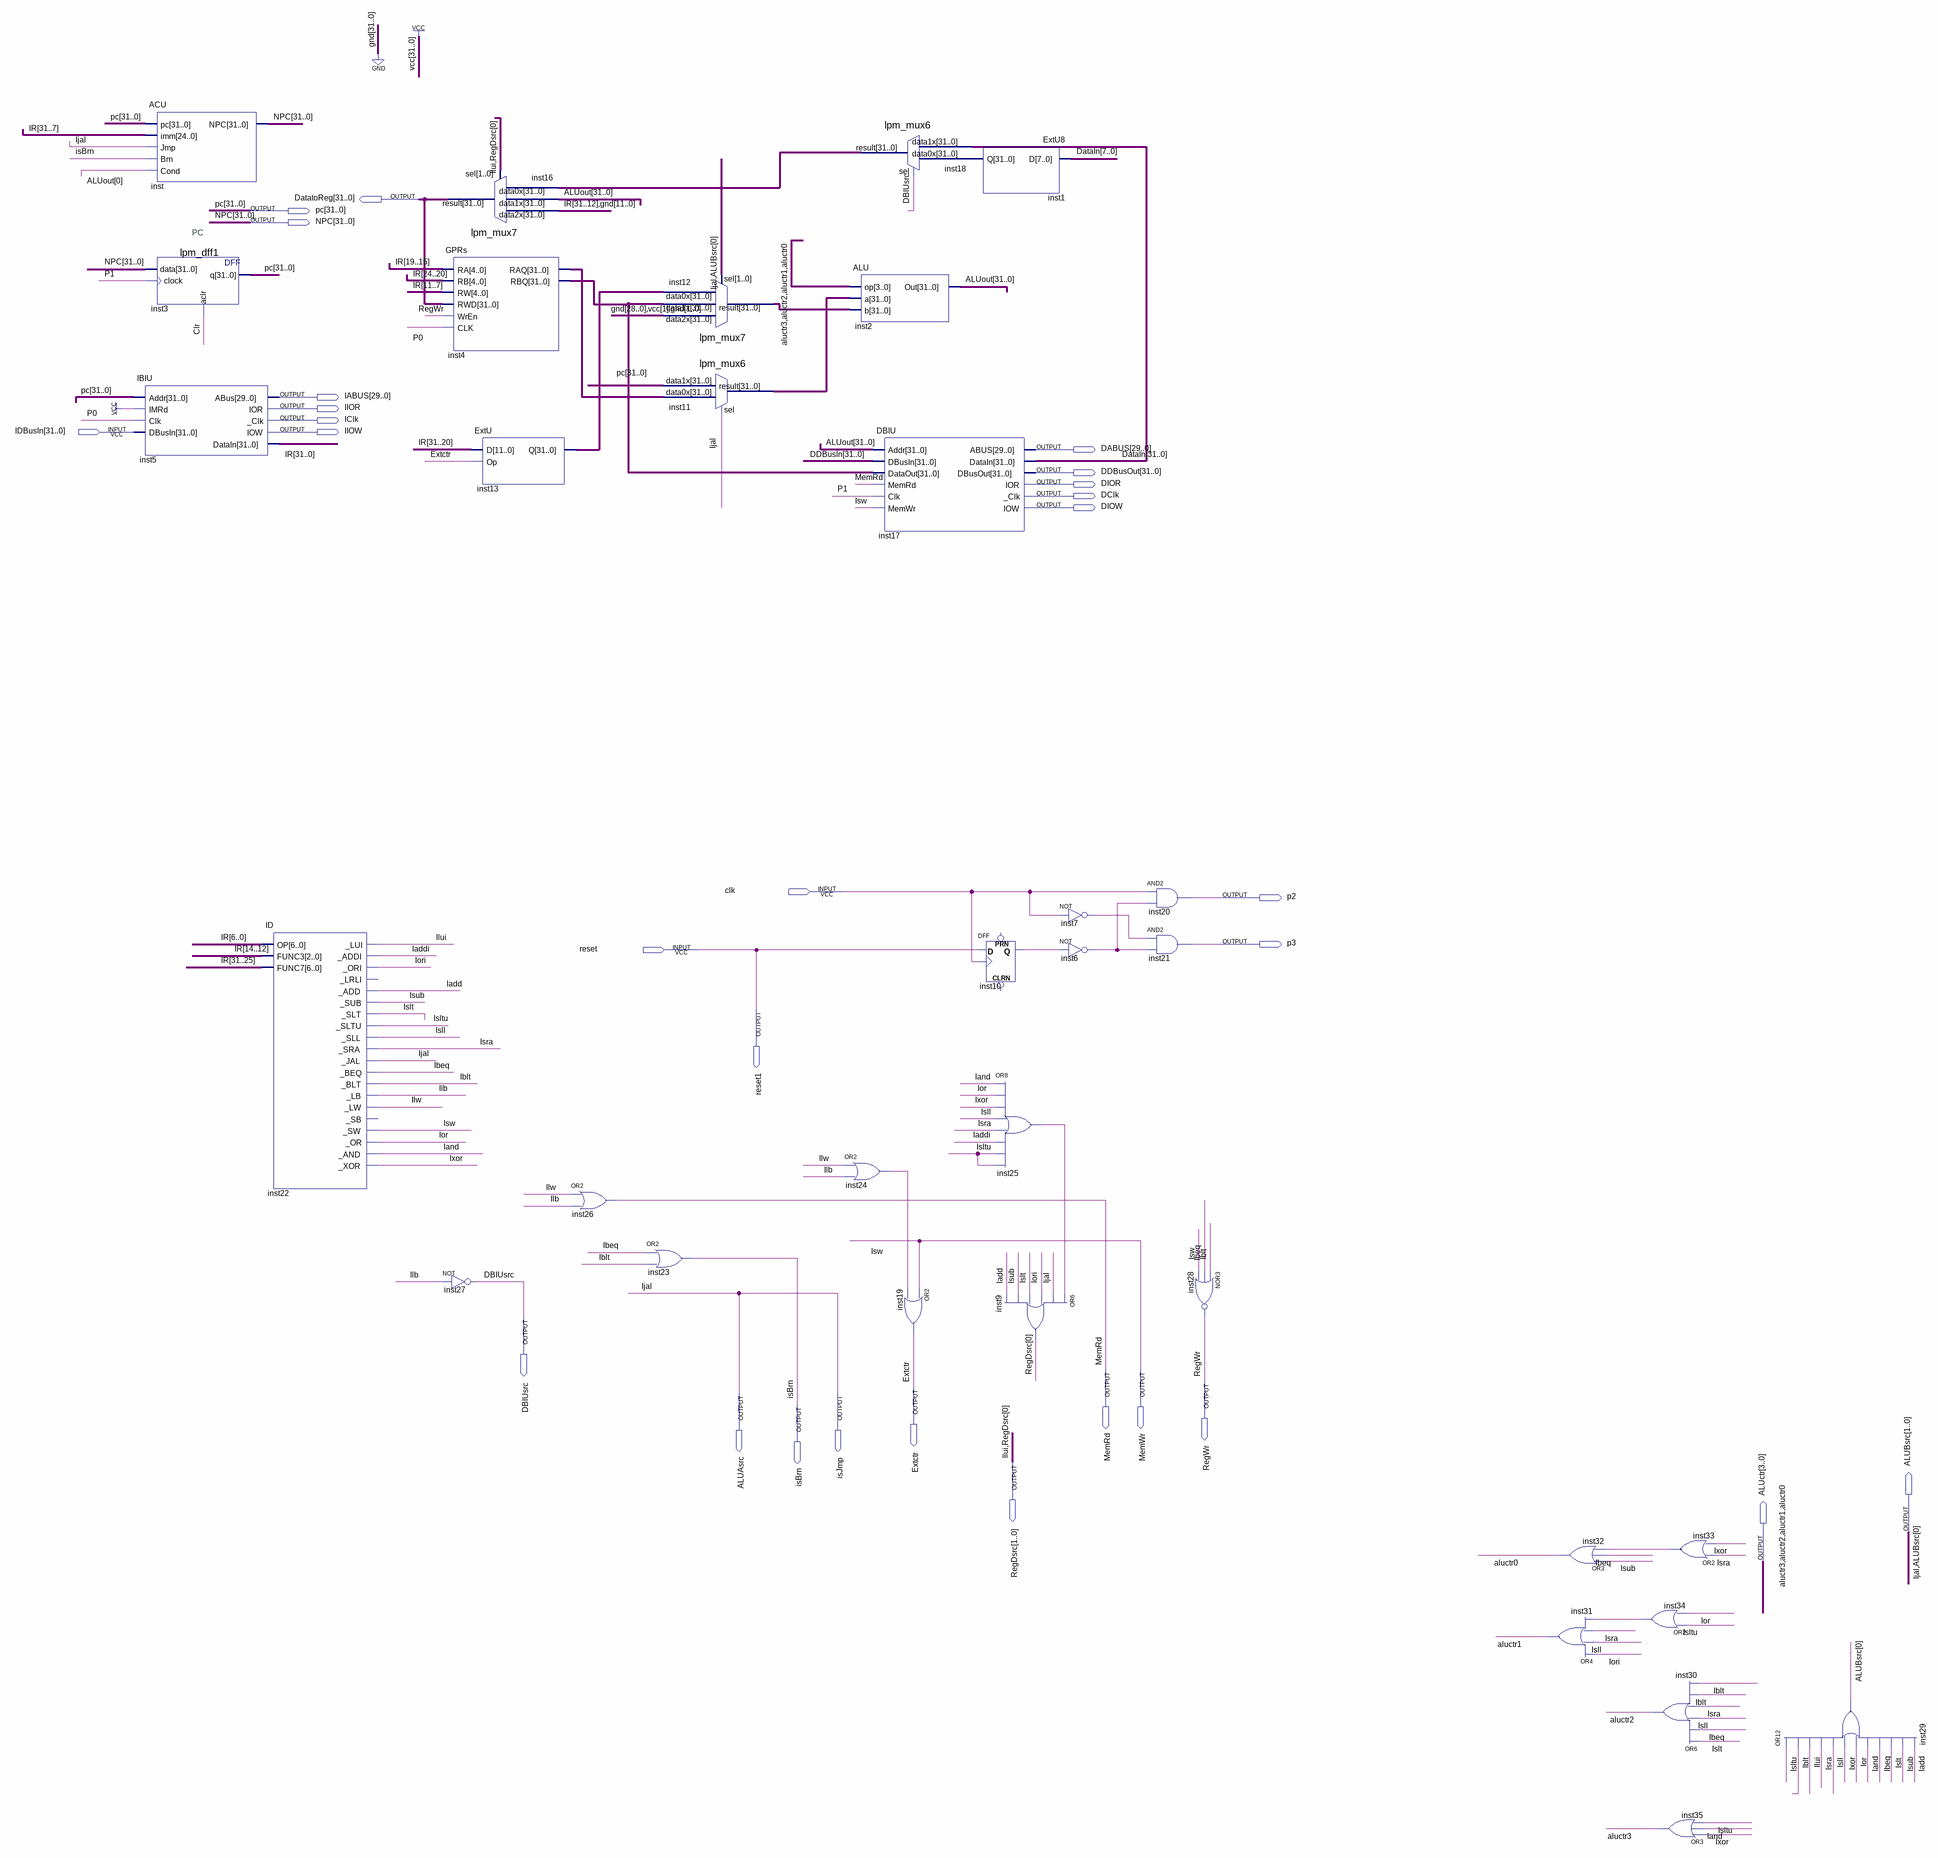
[diagram p0: schematic sheet]
// Quartus schematic cpuworng.bdf as structural Verilog: 33 symbols, 29 pins
module cpuworng (
  input  [31:0] IDBusIn,
  input  clk,
  input  reset,
  output [31:0] DatatoReg,
  output [31:0] pc,
  output [31:0] NPC,
  output [29:0] IABUS,
  output IIOR,
  output IClk,
  output IIOW,
  output [29:0] DABUS,
  output [31:0] DDBusOut,
  output DIOR,
  output DClk,
  output DIOW,
  output p2,
  output p3,
  output reset1,
  output DBIUsrc,
  output MemRd,
  output MemWr,
  output RegWr,
  output Extctr,
  output ALUAsrc,
  output isJmp,
  output isBrn,
  output [1:0] RegDsrc,
  output [1:0] ALUBsrc,
  output [3:0] ALUctr
);

  wire Clr, Iadd, Iaddi, Iand, Ibeq, Iblt, Ilb, Ilw, inst6_out, inst7_out, inst10_q, inst24_out, inst25_out,
       inst33_out, inst34_out, Ior, Iori, Isll, Islt, Isltu, Isra, Isub, Ixor, P0, P1;
  wire [31:0] ALUout, DataIn, DDBusIn, inst1_q, inst4_raq, inst4_rbq, inst11_result, inst12_result, inst13_q,
       inst18_result, IR;

  ACU inst (.pc(pc), .imm(IR[31:7]), .Jmp(ALUAsrc), .Brn(isBrn), .Cond(ALUout[0]), .NPC(NPC));
  lpm_dff1 inst3 (.data(NPC), .clock(P1), .aclr(Clr), .q(pc));
  IBIU inst5 (
    .Addr(pc), .IMRd(1'b1), .Clk(P0), .DBusIn(IDBusIn), .ABus(IABUS), .IOR(IIOR), ._Clk(IClk), .IOW(IIOW),
    .DataIn(IR));
  ID inst22 (
    .OP(IR[6:0]), .FUNC3(IR[14:12]), .FUNC7(IR[31:25]), ._LUI(RegDsrc[1]), ._ADDI(Iaddi), ._ORI(Iori),
    ._ADD(Iadd), ._SUB(Isub), ._SLT(Islt), ._SLTU(Isltu), ._SLL(Isll), ._SRA(Isra), ._JAL(ALUAsrc),
    ._BEQ(Ibeq), ._BLT(Iblt), ._LB(Ilb), ._LW(Ilw), ._SW(MemWr), ._OR(Ior), ._AND(Iand), ._XOR(Ixor));  // open: _LRLI, _SB
  lpm_mux7 inst16 (
    .data2x({IR[31:12], {12{1'b0}}}), .data1x(ALUout), .data0x(inst18_result), .sel(RegDsrc),
    .result(DatatoReg));
  GPRs inst4 (
    .RA(IR[19:15]), .RB(IR[24:20]), .RW(IR[11:7]), .RWD(DatatoReg), .WrEn(RegWr), .CLK(P0), .RAQ(inst4_raq),
    .RBQ(inst4_rbq));
  not inst27 (DBIUsrc, Ilb);
  ExtU inst13 (.D(IR[31:20]), .Op(Extctr), .Q(inst13_q));
  or inst26 (MemRd, Ilw, Ilb);
  lpm_mux7 inst12 (
    .data2x(32'b00000000000000000000000000000100), .data1x(inst4_rbq), .data0x(inst13_q),
    .sel({ALUAsrc, ALUBsrc[0]}), .result(inst12_result));
  lpm_mux6 inst11 (.data1x(pc), .data0x(inst4_raq), .sel(ALUAsrc), .result(inst11_result));
  or inst23 (isBrn, Ibeq, Iblt);
  lpm_mux6 inst18 (.data1x(DataIn), .data0x(inst1_q), .sel(DBIUsrc), .result(inst18_result));
  ALU inst2 (.op(ALUctr), .a(inst11_result), .b(inst12_result), .Out(ALUout));
  or inst24 (inst24_out, Ilw, Ilb);
  DBIU inst17 (
    .Addr(ALUout), .DBusIn(DDBusIn), .DataOut(inst4_rbq), .MemRd(MemRd), .Clk(P1), .MemWr(MemWr),
    .ABUS(DABUS), .DataIn(DataIn), .DBusOut(DDBusOut), .IOR(DIOR), ._Clk(DClk), .IOW(DIOW));
  or inst19 (Extctr, MemWr, inst24_out);
  ExtU8 inst1 (.D(DataIn[7:0]), .Q(inst1_q));
  DFF inst10 (.CLK(clk), .D(reset), .Q(inst10_q));  // open: CLRN, PRN
  or inst25 (inst25_out, Iand, Ior, Ixor, Isll, Isra, Iaddi, Isltu, Isltu);
  or inst9 (RegDsrc[0], inst25_out, ALUAsrc, Iori, Islt, Isub, Iadd);
  not inst7 (inst7_out, clk);
  not inst6 (inst6_out, inst10_q);
  and inst20 (p2, clk, inst6_out);
  and inst21 (p3, inst7_out, inst6_out);
  nor inst28 (RegWr, Iblt, Ibeq, MemWr);
  or inst32 (ALUctr[0], Isub, Ibeq, inst33_out);
  or inst31 (ALUctr[1], Iori, Isll, Isra, inst34_out);
  or inst34 (inst34_out, Isltu, Ior);
  or inst30 (ALUctr[2], Islt, Ibeq, Isll, Isra, Iblt, Iblt);
  or inst35 (ALUctr[3], Ixor, Iand, Isltu);
  or inst33 (inst33_out, Isra, Ixor);
  or inst29 (ALUBsrc[0], Isltu, Iblt, RegDsrc[1], Isra, Isll, Ixor, Ior, Iand, Ibeq, Islt, Isub, Iadd);

  assign ALUBsrc[1] = ALUAsrc;
  assign isJmp = ALUAsrc;
  assign reset1 = reset;

  // Other names for the same wires on the sheet: Ijal = ALUAsrc; Ilui = RegDsrc[1]; Isw = MemWr

  // Notes on the sheet:
  //   PC
endmodule
